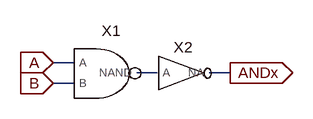
[diagram p0: schematic ANDx.asc]
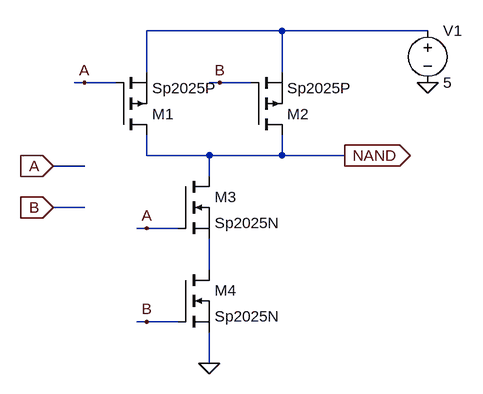
[diagram p1: sub-circuit nand.asc]
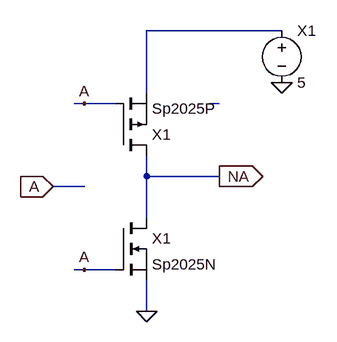
[diagram p2: sub-circuit invert.asc]
ANDx.asc, the LTspice schematic file:
Version 4.1
SHEET 1 880 680
WIRE 80 112 48 112
WIRE 208 128 176 128
WIRE 320 128 288 128
WIRE 80 144 48 144
FLAG 48 112 A
IOPIN 48 112 In
FLAG 48 144 B
IOPIN 48 144 In
FLAG 320 128 ANDx
IOPIN 320 128 Out
SYMBOL NAND 128 128 R0
SYMATTR InstName X1
SYMBOL INVERT 240 128 R0
SYMATTR InstName X2

nand.asc, the sub-circuit schematic file:
Version 4.1.1
SHEET 1 880 680
WIRE 336 -160 128 -160
WIRE 560 -160 336 -160
WIRE 128 -96 128 -160
WIRE 336 -96 336 -160
WIRE 32 -80 16 -80
WIRE 80 -80 32 -80
WIRE 240 -80 224 -80
WIRE 288 -80 240 -80
WIRE 128 32 128 0
WIRE 224 32 128 32
WIRE 336 32 336 0
WIRE 336 32 224 32
WIRE 432 32 336 32
WIRE 32 48 -16 48
WIRE 224 64 224 32
WIRE 32 112 -16 112
WIRE 128 144 112 144
WIRE 176 144 128 144
WIRE 224 208 224 160
WIRE 128 288 112 288
WIRE 176 288 128 288
WIRE 224 352 224 304
FLAG 224 352 0
FLAG -16 48 A
IOPIN -16 48 In
FLAG -16 112 B
IOPIN -16 112 In
FLAG 128 144 A
FLAG 128 288 B
FLAG 32 -80 A
FLAG 240 -80 B
FLAG 432 32 NAND
IOPIN 432 32 Out
FLAG 560 -80 0
SYMBOL pmos 80 0 M180
SYMATTR InstName M1
SYMATTR Value Sp2025P
SYMBOL pmos 288 0 M180
SYMATTR InstName M2
SYMATTR Value Sp2025P
SYMBOL nmos 176 64 R0
SYMATTR InstName M3
SYMATTR Value Sp2025N
SYMBOL nmos 176 208 R0
SYMATTR InstName M4
SYMATTR Value Sp2025N
SYMBOL voltage 560 -176 R0
SYMATTR InstName V1
SYMATTR Value 5

invert.asc, the sub-circuit schematic file:
Version 4
SHEET 1 880 680
WIRE 352 -80 144 -80
WIRE 144 16 144 -80
WIRE 48 32 32 32
WIRE 96 32 48 32
WIRE 256 32 240 32
WIRE 144 144 144 112
WIRE 256 144 144 144
WIRE 48 160 0 160
WIRE 144 208 144 144
WIRE 48 288 32 288
WIRE 96 288 48 288
WIRE 144 352 144 304
FLAG 144 352 0
FLAG 0 160 A
IOPIN 0 160 In
FLAG 48 288 A
FLAG 48 32 A
FLAG 256 144 NA
IOPIN 256 144 Out
FLAG 352 0 0
SYMBOL pmos 96 112 M180
SYMATTR InstName X1
SYMATTR Value Sp2025P
SYMBOL nmos 96 208 R0
SYMATTR InstName X1
SYMATTR Value Sp2025N
SYMBOL voltage 352 -96 R0
SYMATTR InstName X1
SYMATTR Value 5

The netlist it stands for:
* ANDx.asc
X§X1 A B N001 nand
X§X2 N001 ANDx invert

* block symbol definitions
.subckt nand A B NAND
M1 NAND A N001 N001 Sp2025P
M2 NAND B N001 N001 Sp2025P
M3 NAND A N002 N002 Sp2025N
M4 N002 B 0 0 Sp2025N
V1 N001 0 5
.ends nand

.subckt invert A NA
M§X1 NA A N001 N001 Sp2025P
M§X1 NA A 0 0 Sp2025N
V§X1 N001 0 5
.ends invert

.model NMOS NMOS
.model PMOS PMOS
.lib standard.mos
.backanno
.end